# Altium schematic sheet Current_Sensor.SchDoc
size A4
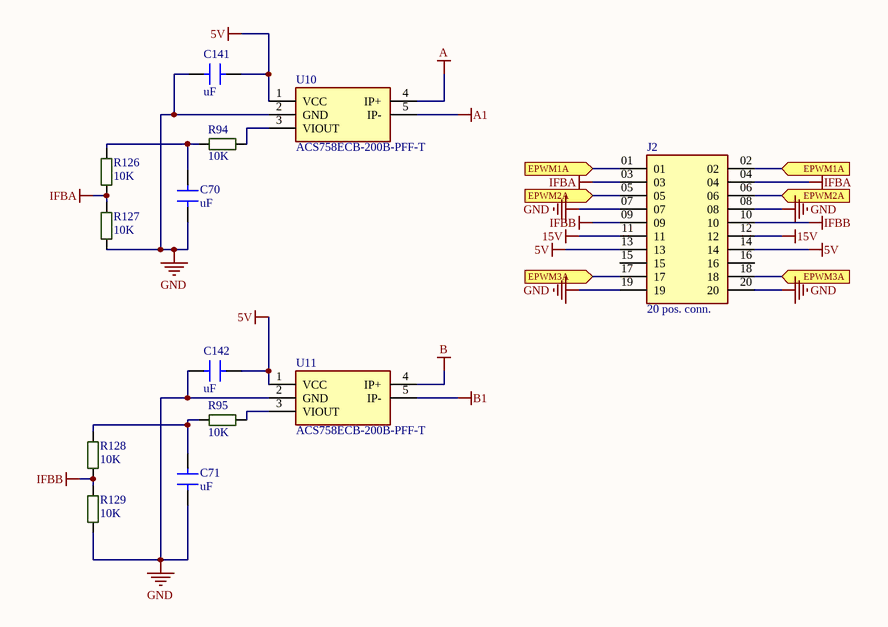
[diagram p0: Current_Sensor.SchDoc]

## Parts
C70  uF  [C-1206]
C71  uF  [C-1206]
C141  uF  [C-1206]
C142  uF  [C-1206]
J2  20 pos. conn.  [SAMTEC_SSQ-110-X-X-D]
R94  10K  [R-1206]
R95  10K  [R-1206]
R126  10K  [R-1206]
R127  10K  [R-1206]
R128  10K  [R-1206]
R129  10K  [R-1206]
U10  ACS758ECB-200B-PFF-T  [ACS756SCA-050B-PFF-T_2]
U11  ACS758ECB-200B-PFF-T  [ACS756SCA-050B-PFF-T_2]

## Ports
EPWM1A (in), EPWM2A (in), EPWM3A (in)

## Nets
5V: C141.1 C142.1 J2.13 J2.14 U10.1(VCC) U11.1(VCC)
15V: J2.11 J2.12
A: U10.4(IP+)
A1: U10.5(IP-)
B: U11.4(IP+)
B1: U11.5(IP-)
GND: C70.1 C71.1 C141.2 C142.2 J2.07 J2.08 J2.19 J2.20 R127.2 R129.2 U10.2(GND) U11.2(GND)
IFBA: J2.03 J2.04 R126.2 R127.1
IFBB: J2.09 J2.10 R128.2 R129.1
EPWM1A: J2.01 J2.02 ; port EPWM1A
EPWM2A: J2.05 J2.06 ; port EPWM2A
EPWM3A: J2.17 J2.18 ; port EPWM3A
NetC70_2: C70.2 R94.2 R126.1
NetC71_2: C71.2 R95.2 R128.1
NetR94_1: R94.1 U10.3(VIOUT)
NetR95_1: R95.1 U11.3(VIOUT)

Not connected (* = marked no-connect by the designer): J2 15 16

## Library data of the parts
C70 C71 C141 C142 = C-1206
J2 = 20 pos. conn.: SSQ - Samtec 2.54mm Square Tail Dual Row Socket Strip 8.5mm Profile - Fast Stock; MP: SSQ-110-23-G-D; MF: Samtec; Purchase-URL: https://pricing.snapeda.com/search/part/SSQ-110-23-G-D/?ref=eda; Value: *; SnapEDA_Link: https://www.snapeda.com/parts/SSQ-110-23-G-D/Samtec/view-part/3247245/?ref=snap; Package: None; Check_prices: https://www.snapeda.com/parts/SSQ-110-23-G-D/Samtec/view-part/3247245/?ref=eda; Price: None; Availability: Bad
R94 R95 R126-R129 = R-1206_GS: 1206S4F1002T5E; ComponentLink1Description: link; ComponentLink1URL: https://www.ozdisan.com/pasif-komponentler/direncler/smt-smd-direncler/1206S4F1002T5E
U10 U11 = ACS758ECB-200B-PFF-T: Undefined or Miscellaneous; Manufacturer_Name: Allegro Microsystems; Datasheet Link: http://www.farnell.com/datasheets/926109.pdf; Manufacturer_Part_Number: ACS758ECB-200B-PFF-T; Arrow Part Number: ACS758ECB-200B-PFF-T; Arrow Price/Stock: https://www.arrow.com/en/products/acs758ecb-200b-pff-t/allegro-microsystems